# Altium schematic sheet Sheet2.SchDoc
size A4
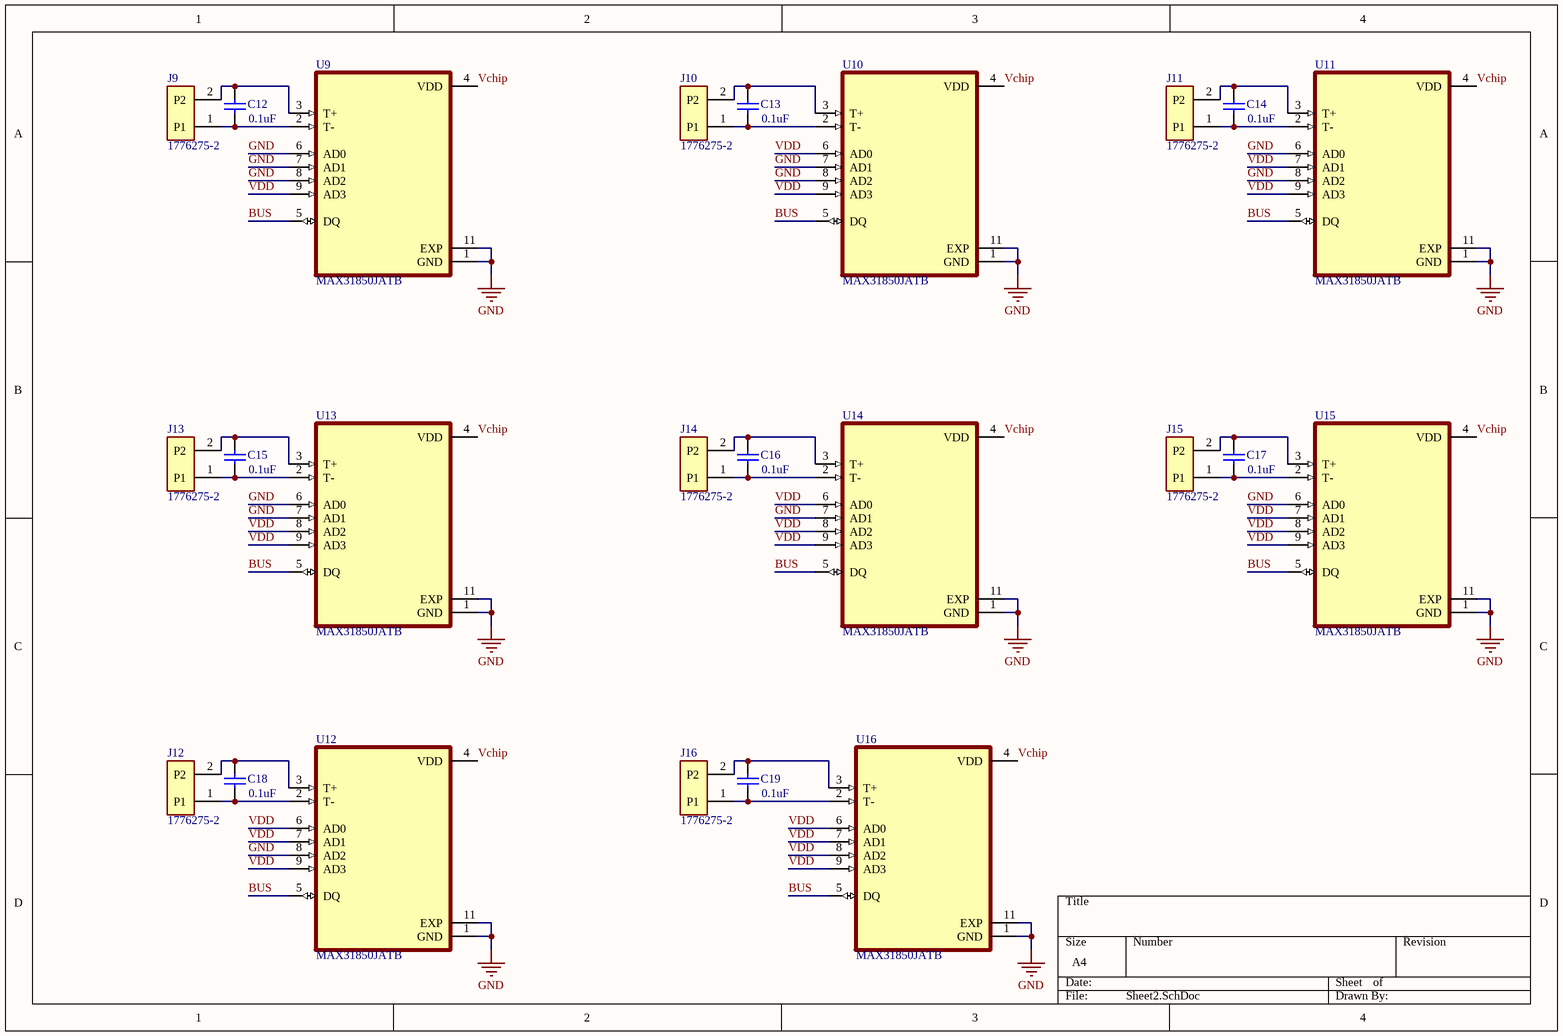
[diagram p0: Sheet2.SchDoc]

## Parts
C12  value 0.1uF  [1608[0603]]
C13  value 0.1uF  [1608[0603]]
C14  value 0.1uF  [1608[0603]]
C15  value 0.1uF  [1608[0603]]
C16  value 0.1uF  [1608[0603]]
C17  value 0.1uF  [1608[0603]]
C18  value 0.1uF  [1608[0603]]
C19  value 0.1uF  [1608[0603]]
J9  1776275-2  [TE_1776275-2]
J10  1776275-2  [TE_1776275-2]
J11  1776275-2  [TE_1776275-2]
J12  1776275-2  [TE_1776275-2]
J13  1776275-2  [TE_1776275-2]
J14  1776275-2  [TE_1776275-2]
J15  1776275-2  [TE_1776275-2]
J16  1776275-2  [TE_1776275-2]
U9  MAX31850JATB  [SON50P300X400X80-11N]
U10  MAX31850JATB  [SON50P300X400X80-11N]
U11  MAX31850JATB  [SON50P300X400X80-11N]
U12  MAX31850JATB  [SON50P300X400X80-11N]
U13  MAX31850JATB  [SON50P300X400X80-11N]
U14  MAX31850JATB  [SON50P300X400X80-11N]
U15  MAX31850JATB  [SON50P300X400X80-11N]
U16  MAX31850JATB  [SON50P300X400X80-11N]

## Nets
GND: U9.1(GND) U9.6(AD0) U9.7(AD1) U9.8(AD2) U9.11(EXP) U10.1(GND) U10.7(AD1) U10.8(AD2) U10.11(EXP) U11.1(GND) U11.6(AD0) U11.8(AD2) U11.11(EXP) U12.1(GND) U12.8(AD2) U12.11(EXP) U13.1(GND) U13.6(AD0) U13.7(AD1) U13.11(EXP) U14.1(GND) U14.7(AD1) U14.11(EXP) U15.1(GND) U15.6(AD0) U15.11(EXP) U16.1(GND) U16.11(EXP)
BUS: U9.5(DQ) U10.5(DQ) U11.5(DQ) U12.5(DQ) U13.5(DQ) U14.5(DQ) U15.5(DQ) U16.5(DQ)
Vchip: U9.4(VDD) U10.4(VDD) U11.4(VDD) U12.4(VDD) U13.4(VDD) U14.4(VDD) U15.4(VDD) U16.4(VDD)
VDD: U9.9(AD3) U10.6(AD0) U10.9(AD3) U11.7(AD1) U11.9(AD3) U12.6(AD0) U12.7(AD1) U12.9(AD3) U13.8(AD2) U13.9(AD3) U14.6(AD0) U14.8(AD2) U14.9(AD3) U15.7(AD1) U15.8(AD2) U15.9(AD3) U16.6(AD0) U16.7(AD1) U16.8(AD2) U16.9(AD3)
NetC12_1: C12.1 J9.1(P1) U9.2(T-)
NetC12_2: C12.2 J9.2(P2) U9.3(T+)
NetC13_1: C13.1 J10.1(P1) U10.2(T-)
NetC13_2: C13.2 J10.2(P2) U10.3(T+)
NetC14_1: C14.1 J11.1(P1) U11.2(T-)
NetC14_2: C14.2 J11.2(P2) U11.3(T+)
NetC15_1: C15.1 J13.1(P1) U13.2(T-)
NetC15_2: C15.2 J13.2(P2) U13.3(T+)
NetC16_1: C16.1 J14.1(P1) U14.2(T-)
NetC16_2: C16.2 J14.2(P2) U14.3(T+)
NetC17_1: C17.1 J15.1(P1) U15.2(T-)
NetC17_2: C17.2 J15.2(P2) U15.3(T+)
NetC18_1: C18.1 J12.1(P1) U12.2(T-)
NetC18_2: C18.2 J12.2(P2) U12.3(T+)
NetC19_1: C19.1 J16.1(P1) U16.2(T-)
NetC19_2: C19.2 J16.2(P2) U16.3(T+)

## Library data of the parts
C12-C19 = Cap Semi: Capacitor (Semiconductor SIM Model); Published: 8-Jun-2000; LatestRevisionDate: 29-May-2009; LatestRevisionNote: IPC-7351 Footprint Added.; PackageReference: C1206; Publisher: Altium Limited; PackageDescription: Chip Capacitor
J9-J16 = 1776275-2: TERM BLOCK 2POS SIDE ENT 3.5MM; MF: {'manufacturer': u'TE Connectivity'}; Value: *; MP: 1776275-2; Availability: Unavailable; Price: None; Package: None
U9-U16 = MAX31850JATB: None; MF: {'manufacturer': u'Maxim Integrated'}; Value: *; MP: MAX31850JATB; Availability: Unavailable; Price: None; Package: None